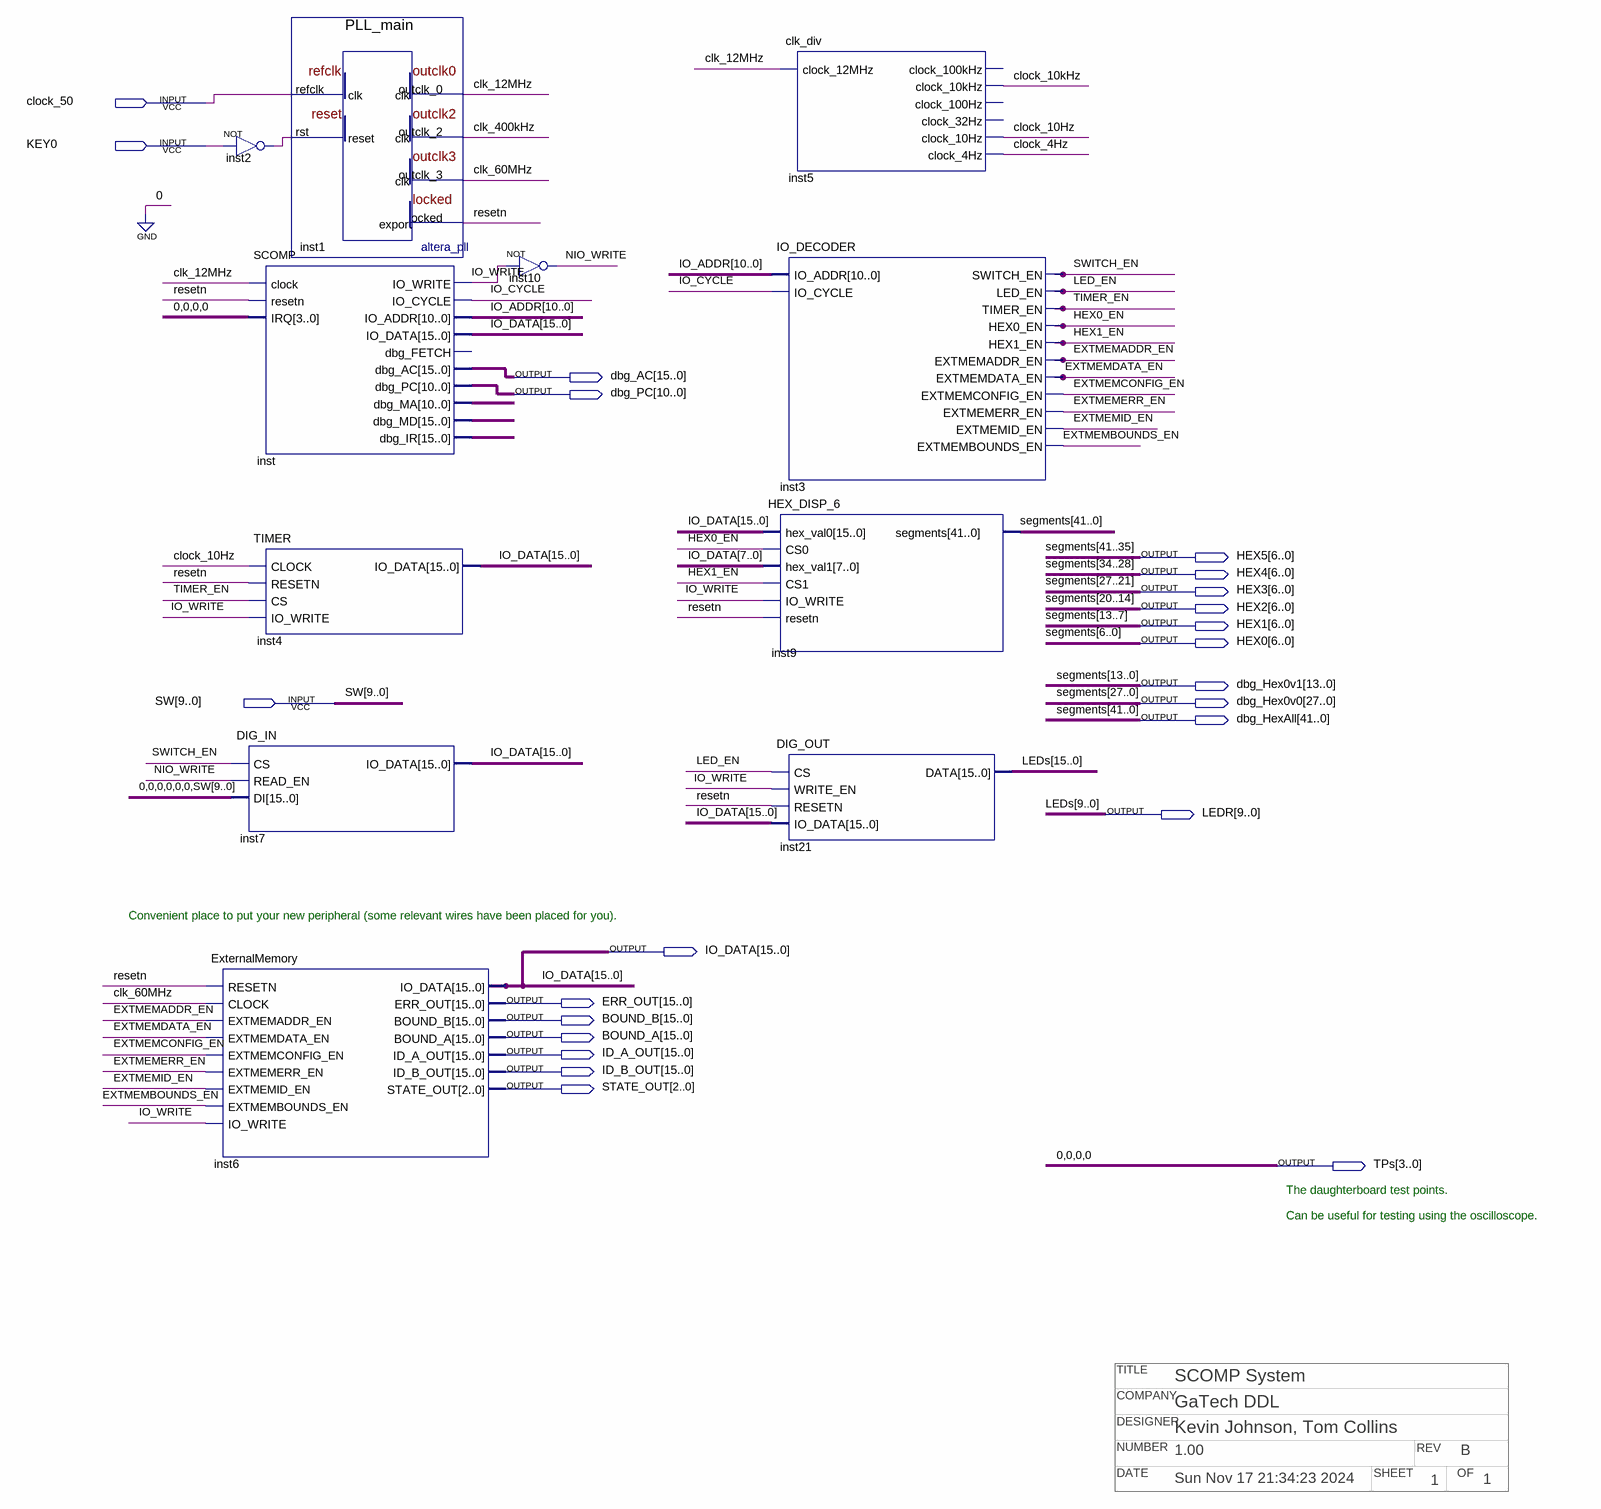
[diagram p0: schematic sheet]
// Quartus schematic SCOMP_System.bdf as structural Verilog: 11 symbols, 23 pins
// Title block: TITLE: SCOMP System; COMPANY: GaTech DDL; DESIGNER: Kevin Johnson, Tom Collins; NUMBER: 1.00; REV: B; DATE: Sun Nov 17 21:34:23 2024; SHEET: 1; OF: 1
module SCOMP_System (
  input  clock_50,
  input  KEY0,
  input  [9:0] SW,
  output [15:0] dbg_AC,
  output [10:0] dbg_PC,
  output [6:0] HEX5,
  output [6:0] HEX4,
  output [6:0] HEX3,
  output [6:0] HEX2,
  output [6:0] HEX1,
  output [6:0] HEX0,
  output [13:0] dbg_Hex0v1,
  output [27:0] dbg_Hex0v0,
  output [41:0] dbg_HexAll,
  output [9:0] LEDR,
  output [15:0] IO_DATA,
  output [15:0] ERR_OUT,
  output [15:0] BOUND_B,
  output [15:0] BOUND_A,
  output [15:0] ID_A_OUT,
  output [15:0] ID_B_OUT,
  output [2:0] STATE_OUT,
  output [3:0] TPs
);

  wire clk_12MHz, clk_60MHz, clk_400kHz, clock_4Hz, clock_10Hz, clock_10kHz, EXTMEMADDR_EN, EXTMEMBOUNDS_EN,
       EXTMEMCONFIG_EN, EXTMEMDATA_EN, EXTMEMERR_EN, EXTMEMID_EN, HEX0_EN, HEX1_EN, inst2_out, IO_CYCLE,
       IO_WRITE, LED_EN, NIO_WRITE, resetn, SWITCH_EN, TIMER_EN;
  wire [10:0] inst_dbg_ma, IO_ADDR;
  wire [15:0] inst_dbg_ir, inst_dbg_md;
  wire [15:10] LEDs;

  not inst2 (inst2_out, KEY0);
  SCOMP inst (
    .clock(clk_12MHz), .resetn(resetn), .IRQ(4'b0000), .IO_WRITE(IO_WRITE), .IO_CYCLE(IO_CYCLE),
    .IO_ADDR(IO_ADDR), .dbg_AC(dbg_AC), .dbg_PC(dbg_PC), .dbg_MA(inst_dbg_ma), .dbg_MD(inst_dbg_md),
    .dbg_IR(inst_dbg_ir), .IO_DATA(IO_DATA));  // open: dbg_FETCH
  TIMER inst4 (.CLOCK(clock_10Hz), .RESETN(resetn), .CS(TIMER_EN), .IO_WRITE(IO_WRITE), .IO_DATA(IO_DATA));
  DIG_IN inst7 (.CS(SWITCH_EN), .READ_EN(NIO_WRITE), .DI({{6{1'b0}}, SW}), .IO_DATA(IO_DATA));
  ExternalMemory inst6 (
    .RESETN(resetn), .CLOCK(clk_60MHz), .EXTMEMADDR_EN(EXTMEMADDR_EN), .EXTMEMDATA_EN(EXTMEMDATA_EN),
    .EXTMEMCONFIG_EN(EXTMEMCONFIG_EN), .EXTMEMERR_EN(EXTMEMERR_EN), .EXTMEMID_EN(EXTMEMID_EN),
    .EXTMEMBOUNDS_EN(EXTMEMBOUNDS_EN), .IO_WRITE(IO_WRITE), .ERR_OUT(ERR_OUT), .BOUND_B(BOUND_B),
    .BOUND_A(BOUND_A), .ID_A_OUT(ID_A_OUT), .ID_B_OUT(ID_B_OUT), .STATE_OUT(STATE_OUT), .IO_DATA(IO_DATA));
  PLL_main inst1 (
    .refclk(clock_50), .rst(inst2_out), .outclk_0(clk_12MHz), .outclk_2(clk_400kHz), .outclk_3(clk_60MHz),
    .locked(resetn));
  not inst10 (NIO_WRITE, IO_WRITE);
  clk_div inst5 (
    .clock_12MHz(clk_12MHz), .clock_10kHz(clock_10kHz), .clock_10Hz(clock_10Hz), .clock_4Hz(clock_4Hz));  // open: clock_100kHz, clock_100Hz, clock_32Hz
  IO_DECODER inst3 (
    .IO_ADDR(IO_ADDR), .IO_CYCLE(IO_CYCLE), .SWITCH_EN(SWITCH_EN), .LED_EN(LED_EN), .TIMER_EN(TIMER_EN),
    .HEX0_EN(HEX0_EN), .HEX1_EN(HEX1_EN), .EXTMEMADDR_EN(EXTMEMADDR_EN), .EXTMEMDATA_EN(EXTMEMDATA_EN),
    .EXTMEMCONFIG_EN(EXTMEMCONFIG_EN), .EXTMEMERR_EN(EXTMEMERR_EN), .EXTMEMID_EN(EXTMEMID_EN),
    .EXTMEMBOUNDS_EN(EXTMEMBOUNDS_EN));
  HEX_DISP_6 inst9 (
    .hex_val0(IO_DATA), .CS0(HEX0_EN), .hex_val1(IO_DATA[7:0]), .CS1(HEX1_EN), .IO_WRITE(IO_WRITE),
    .resetn(resetn), .segments({dbg_HexAll[41:28], dbg_Hex0v0}));
  DIG_OUT inst21 (.CS(LED_EN), .WRITE_EN(IO_WRITE), .RESETN(resetn), .IO_DATA(IO_DATA), .DATA({LEDs, LEDR}));

  assign dbg_Hex0v1 = dbg_Hex0v0[13:0];
  assign dbg_HexAll[27:0] = dbg_Hex0v0;
  assign HEX0 = dbg_Hex0v0[6:0];
  assign HEX1 = dbg_Hex0v0[13:7];
  assign HEX2 = dbg_Hex0v0[20:14];
  assign HEX3 = dbg_Hex0v0[27:21];
  assign HEX4 = dbg_HexAll[34:28];
  assign HEX5 = dbg_HexAll[41:35];
  assign TPs = 4'b0000;

  // Other names for the same wires on the sheet: LEDs[9:0] = LEDR; segments[41:0] = {dbg_HexAll[41:28], dbg_Hex0v0}

  // Notes on the sheet:
  //   Convenient place to put your new peripheral (some relevant wires have been placed for you).
  //   The daughterboard test points.
  //   Can be useful for testing using the oscilloscope.
endmodule
